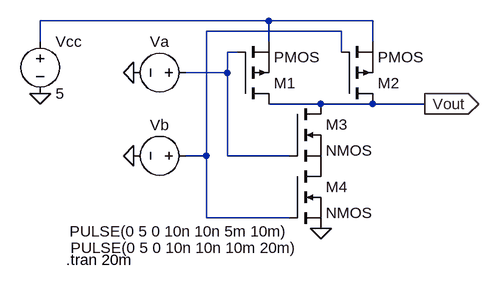
[diagram p0: schematic cmos_nand.asc]
cmos_nand.asc, the LTspice schematic file:
Version 4.1
SHEET 1 880 680
WIRE 112 0 -240 0
WIRE 272 0 112 0
WIRE 224 16 16 16
WIRE -240 32 -240 0
WIRE 112 32 112 0
WIRE 272 32 272 0
WIRE 64 48 48 48
WIRE 224 48 224 16
WIRE 48 80 48 48
WIRE 48 80 -16 80
WIRE 192 128 112 128
WIRE 272 128 192 128
WIRE 352 128 272 128
WIRE 16 208 16 16
WIRE 16 208 -16 208
WIRE 48 208 48 80
WIRE 144 208 48 208
WIRE 16 304 16 208
WIRE 144 304 16 304
FLAG 192 320 0
FLAG -240 112 0
FLAG -96 80 0
FLAG -96 208 0
FLAG 352 128 Vout
IOPIN 352 128 Out
SYMBOL nmos 144 128 R0
SYMATTR InstName M3
SYMBOL pmos 64 128 M180
SYMATTR InstName M1
SYMBOL pmos 224 128 M180
SYMATTR InstName M2
SYMBOL nmos 144 224 R0
SYMATTR InstName M4
SYMBOL voltage -240 16 R0
SYMATTR InstName Vcc
SYMATTR Value 5
SYMBOL voltage 0 80 R90
WINDOW 0 -32 56 VBottom 2
WINDOW 3 229 26 VTop 2
WINDOW 123 0 0 Left 0
WINDOW 39 0 0 Left 0
SYMATTR InstName Va
SYMATTR Value PULSE(0 5 0 10n 10n 5m 10m)
SYMBOL voltage 0 208 R90
WINDOW 0 -32 56 VBottom 2
WINDOW 3 126 18 VTop 2
WINDOW 123 0 0 Left 0
WINDOW 39 0 0 Left 0
SYMATTR InstName Vb
SYMATTR Value PULSE(0 5 0 10n 10n 10m 20m)
TEXT -200 368 Left 2 !.tran 20m

The netlist it stands for:
* cmos_nand.asc
M3 Vout N003 P001 P001 NMOS
M1 Vout N003 N001 N001 PMOS
M2 Vout N002 N001 N001 PMOS
M4 P001 N002 0 0 NMOS
Vcc N001 0 5
Va N003 0 PULSE(0 5 0 10n 10n 5m 10m)
Vb N002 0 PULSE(0 5 0 10n 10n 10m 20m)
.model NMOS NMOS
.model PMOS PMOS
.lib standard.mos
.tran 20m
.backanno
.end